# EAGLE board mcat-4cu-b-v2g (EAGLE 6.6.0)
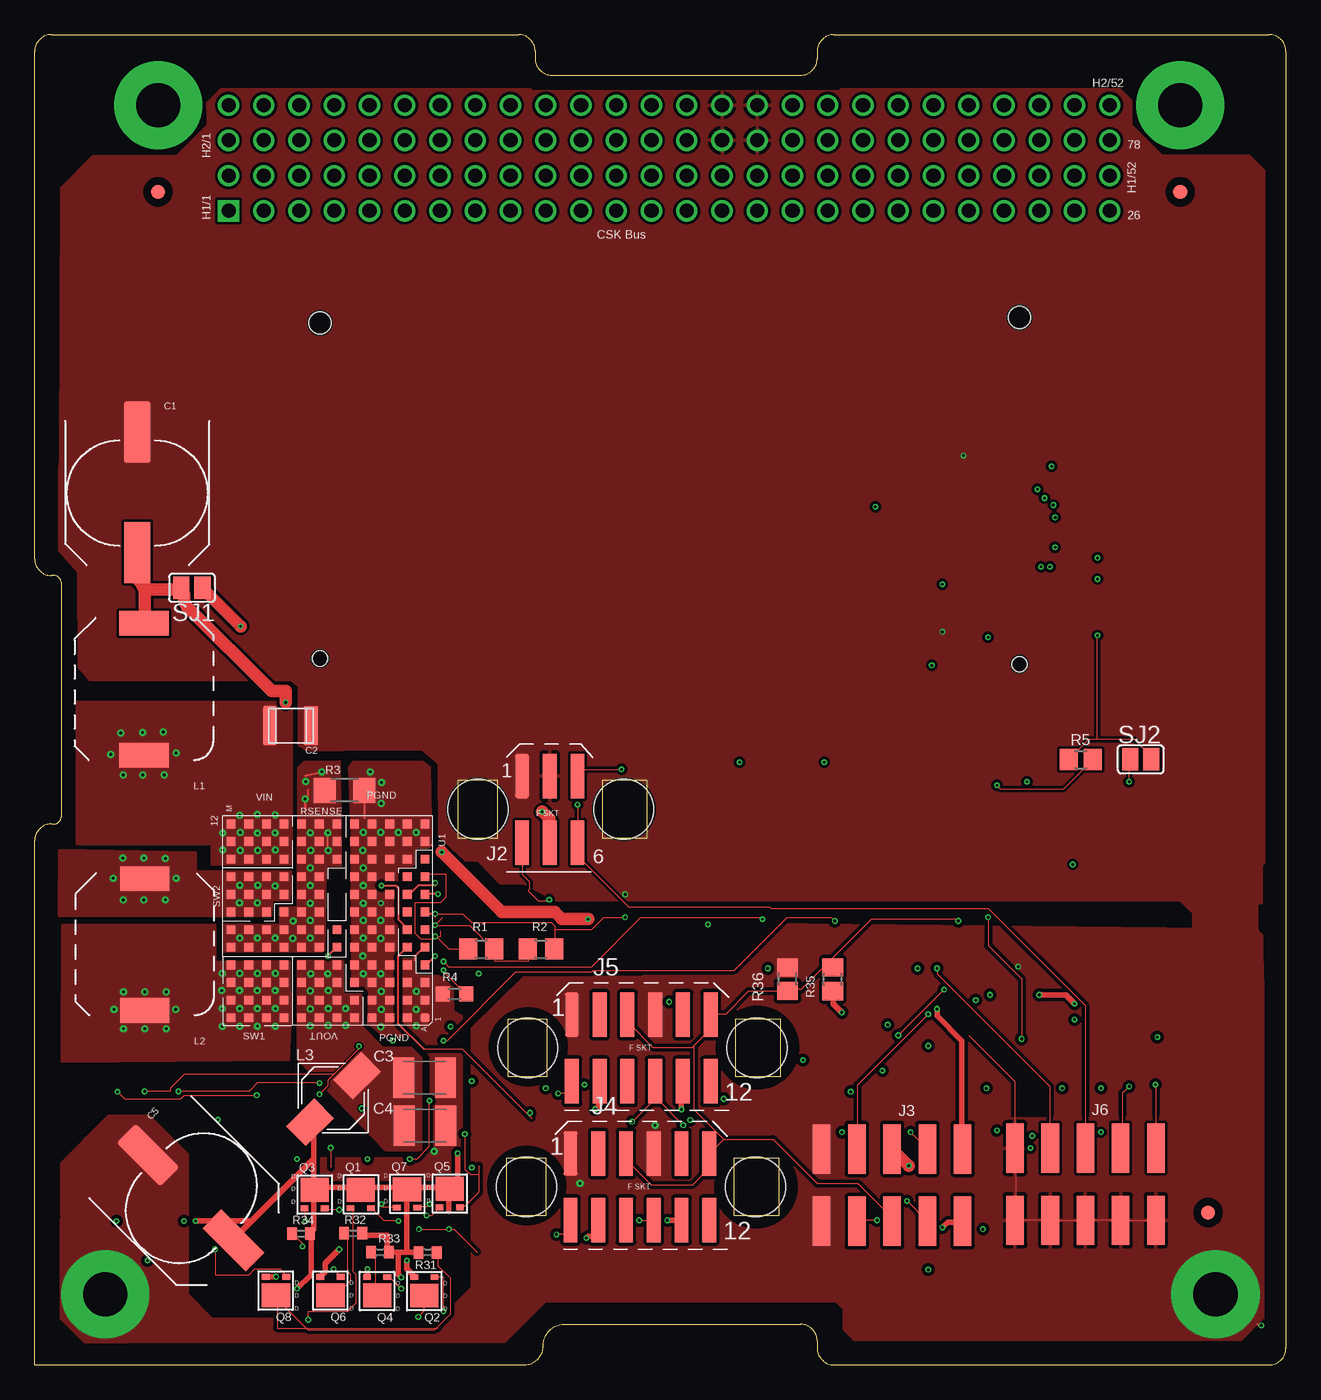
[diagram p5: board, top side]
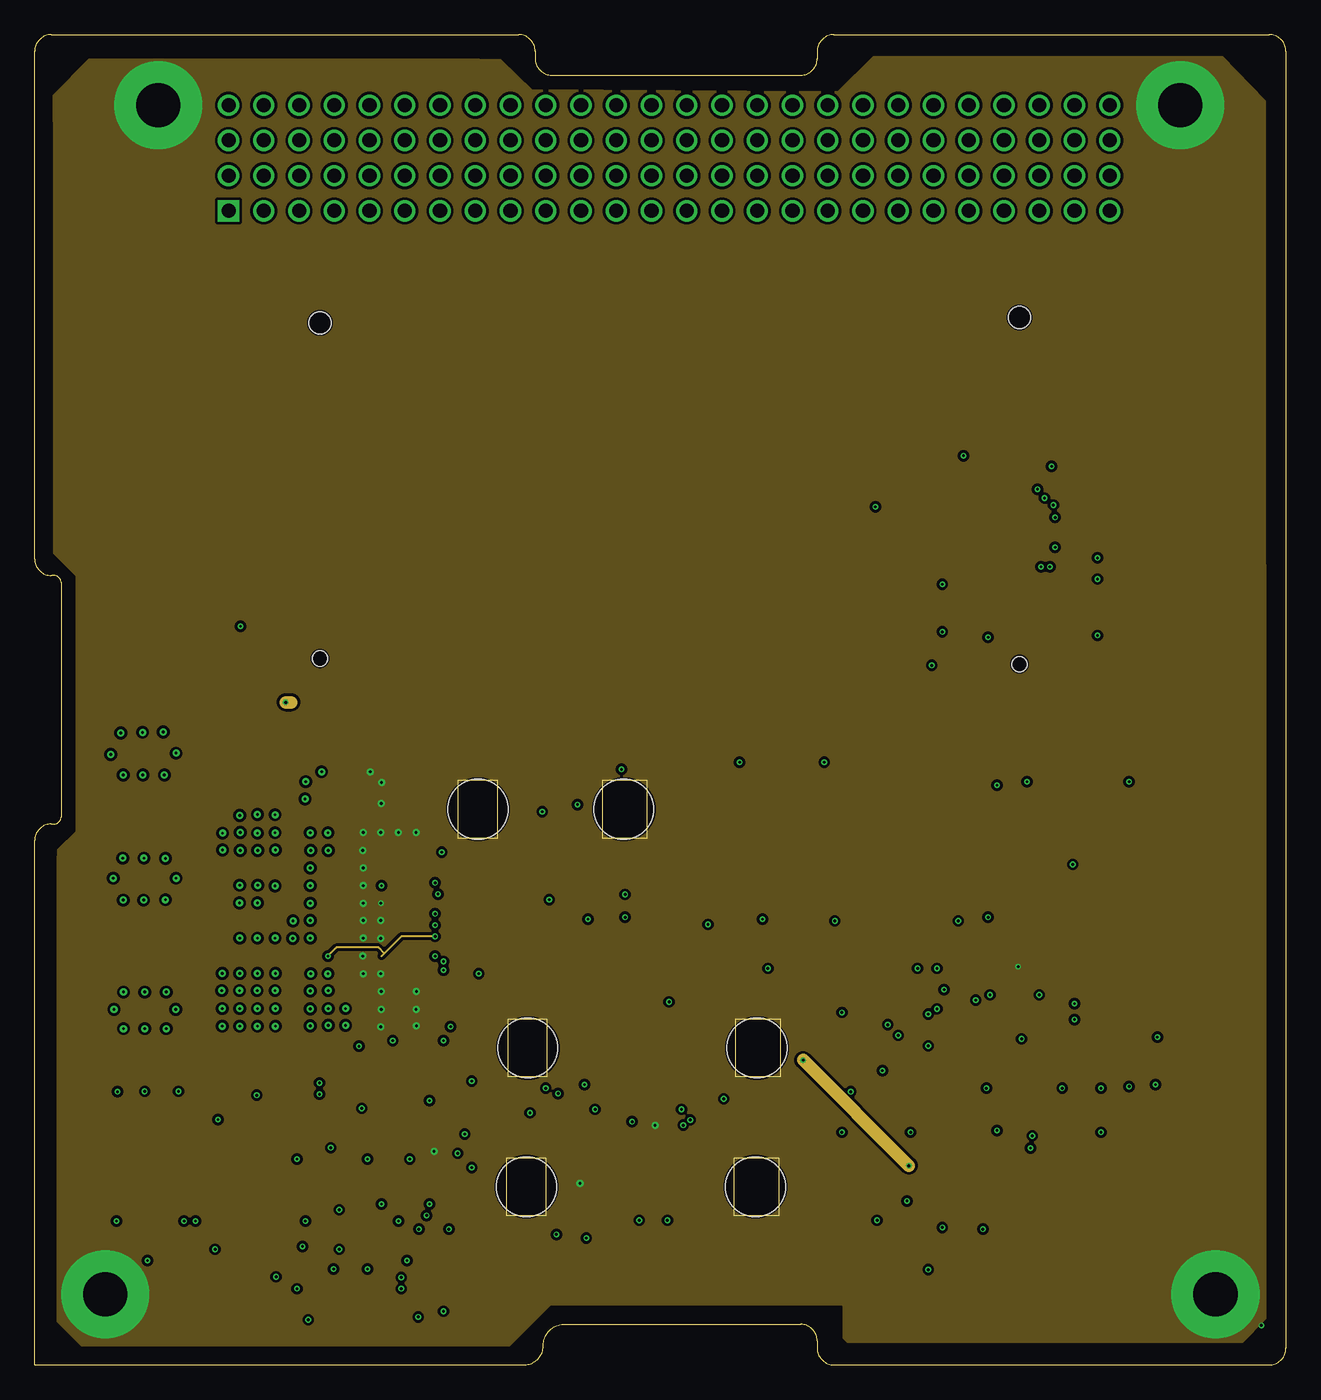
[diagram p6: board, inner layer GND_PLANE]
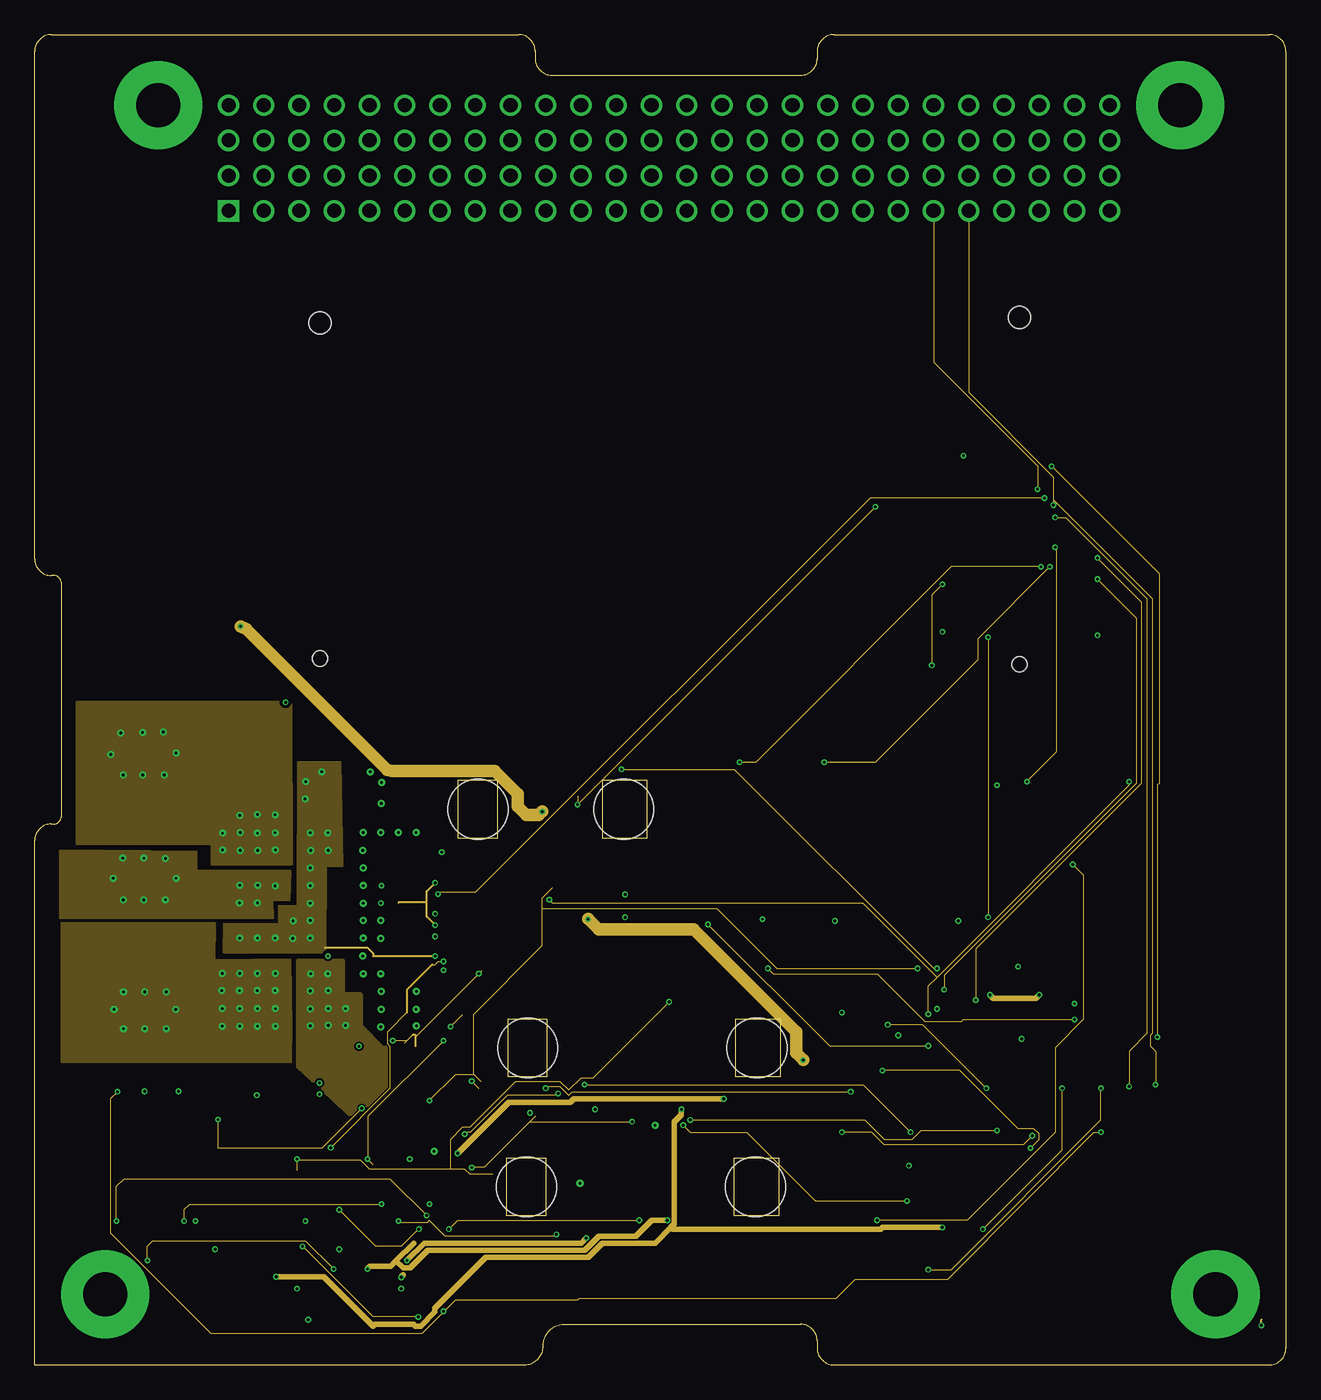
[diagram p7: board, inner layer GND_PLANE/TRACE]
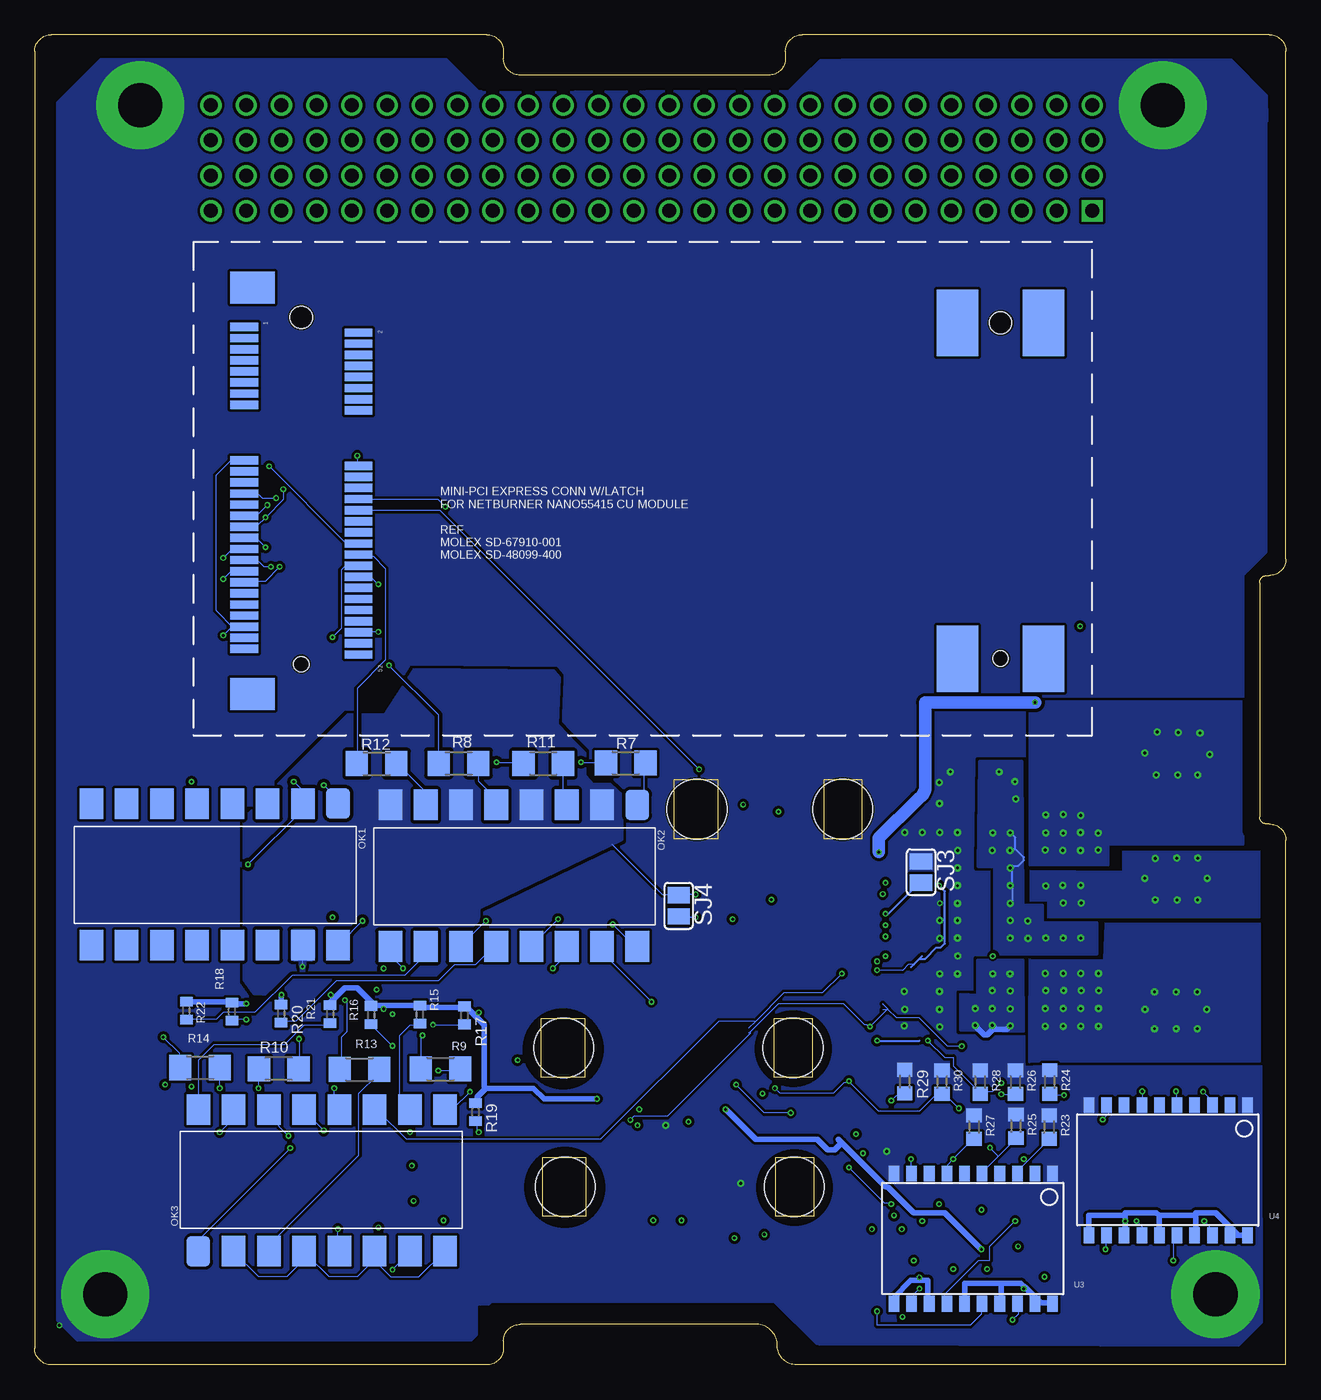
[diagram p8: board, bottom side, seen from below]

Size 90.17 x 95.89 mm. Coordinates in mm from the lower left corner, seen from the top.
Outline: 0,0 34.87,0 35.28,0 arc90 36.65,1.37 arc-90 38.12,2.92 55.19,2.92 arc-90 56.39,1.73 56.39,1.19 arc90 57.58,0 88.98,0 arc90 90.17,1.19 90.17,94.69 arc90 88.98,95.89 57.58,95.89 arc90 56.39,94.69 56.39,94.16 arc-90 55.19,92.96 37.26,92.96 arc-90 36.07,94.16 36.07,94.69 arc90 34.87,95.89 1.19,95.89 arc90 0,94.69 0,58.09 arc90 1.19,56.9 1.4,56.9 arc-90 1.91,56.39 1.91,39.5 arc-90 1.4,38.99 1.19,38.99 arc90 0,37.8 0,0
Copper layers (1+2*15+16): Top 0.035559375mm / dielectric 3.5mil / GND_PLANE 0.01778125mm / dielectric 47mil / GND_PLANE/TRACE 0.01778125mm / dielectric 3.5mil / Bottom 0.035559375mm
Design rules "mcat-4cu-b-v2g *": minimum track width 2mil, minimum drill 8mil, track to track 5mil, track to pad 5mil, pad to pad 5mil, via to via 5mil, smd to smd 5mil, copper to edge 5mil, drill to drill 5mil, minimum pad ring 8mil, minimum via ring 4mil, stop-mask expansion 0mil, vias tented up to drill 8mil, thermal gap 10mil
Net classes: 0 default: clearance 0.205 mm; 1 vout1a2ozcu: width 0.381 mm; 2 vin2a2ozcu: width 0.889 mm
tRestrict: 27 lines
bRestrict: 31 lines

## Footprints (pad centres in the part's own frame; a part is rotated, then mirrored left to right if it is on the bottom)
OS-CON-SVPF-F12 = smd 1.9 x 4.4: A1 0,-4.3; K1 0,4.4
MLCC-X7R-1210 = smd 1 x 2.8: 1 1.6,0.05; 2 -1.35,0.05
C1210K = smd 1.5 x 2.9: 1 -1.5,0; 2 1.5,0
FIDUCIAL_1MM = smd 1 x 1: 1 0,0
CSK-BUS-PKG = drill 1.016 pad 1.524 square: 1 -29.21,-3.81 | drill 1.016 pad 1.524: 2 -29.21,-1.27; 3 -26.67,-3.81; 4 -26.67,-1.27; 5 -24.13,-3.81; 6 -24.13,-1.27; 7 -21.59,-3.81; 8 -21.59,-1.27; 9 -19.05,-3.81; 10 -19.05,-1.27; 11 -16.51,-3.81; 12 -16.51,-1.27; 13 -13.97,-3.81; 14 -13.97,-1.27; 15 -11.43,-3.81; 16 -11.43,-1.27; 17 -8.89,-3.81; 18 -8.89,-1.27; 19 -6.35,-3.81; 20 -6.35,-1.27; 21 -3.81,-3.81; 22 -3.81,-1.27; 23 -1.27,-3.81; 24 -1.27,-1.27; 25 1.27,-3.81; 26 1.27,-1.27; 27 3.81,-3.81; 28 3.81,-1.27; 29 6.35,-3.81; 30 6.35,-1.27; 31 8.89,-3.81; 32 8.89,-1.27; 33 11.43,-3.81; 34 11.43,-1.27; 35 13.97,-3.81; 36 13.97,-1.27; 37 16.51,-3.81; 38 16.51,-1.27; 39 19.05,-3.81; 40 19.05,-1.27; 41 21.59,-3.81; 42 21.59,-1.27; 43 24.13,-3.81; 44 24.13,-1.27; 45 26.67,-3.81; 46 26.67,-1.27; 47 29.21,-3.81; 48 29.21,-1.27; 49 31.75,-3.81; 50 31.75,-1.27; 51 34.29,-3.81; 52 34.29,-1.27; 53 -29.21,1.27; 54 -29.21,3.81; 55 -26.67,1.27; 56 -26.67,3.81; 57 -24.13,1.27; 58 -24.13,3.81; 59 -21.59,1.27; 60 -21.59,3.81; 61 -19.05,1.27; 62 -19.05,3.81; 63 -16.51,1.27; 64 -16.51,3.81; 65 -13.97,1.27; 66 -13.97,3.81; 67 -11.43,1.27; 68 -11.43,3.81; 69 -8.89,1.27; 70 -8.89,3.81; 71 -6.35,1.27; 72 -6.35,3.81; 73 -3.81,1.27; 74 -3.81,3.81; 75 -1.27,1.27; 76 -1.27,3.81; 77 1.27,1.27; 78 1.27,3.81; 79 3.81,1.27; 80 3.81,3.81; 81 6.35,1.27; 82 6.35,3.81; 83 8.89,1.27; 84 8.89,3.81; 85 11.43,1.27; 86 11.43,3.81; 87 13.97,1.27; 88 13.97,3.81; 89 16.51,1.27; 90 16.51,3.81; 91 19.05,1.27; 92 19.05,3.81; 93 21.59,1.27; 94 21.59,3.81; 95 24.13,1.27; 96 24.13,3.81; 97 26.67,1.27; 98 26.67,3.81; 99 29.21,1.27; 100 29.21,3.81; 101 31.75,1.27; 102 31.75,3.81; 103 34.29,1.27; 104 34.29,3.81
M80-68106 = smd 1 x 3.2: 1 -2,2.4; 2 0,2.4; 3 2,2.4; 4 -2,-2.4; 5 0,-2.4; 6 2,-2.4 | hole 4.318: -5.175,0; 5.335,0
AMPMODU-SMT-PIN-HEADER-5X2 = smd 1.27 x 3.556: 1 -4.826,2.54; 2 -2.286,2.54; 3 0.254,2.54; 4 2.794,2.54; 5 5.334,2.54; 6 -4.826,-2.667; 7 -2.286,-2.667; 8 0.254,-2.667; 9 2.794,-2.667; 10 5.334,-2.667
M80-68112 = smd 1 x 3.2: 1 0,2.4; 2 2,2.4; 3 4,2.4; 4 6,2.4; 5 8,2.4; 6 10,2.4; 7 0,-2.4; 8 2,-2.4; 9 4,-2.4; 10 6,-2.4; 11 8,-2.4; 12 10,-2.4 | hole 4.318: -3.175,0; 13.335,0
MSS1048 = smd 3.56 x 1.78: 1 5,9.85; 2 5,0.35
SERIES-POWER-INDUCTORS = smd 2.85 x 2 rotated 45: 1 1.75,1.6; 2 -1.65,-1.75
PS2501L-4 = smd 2.2 x 1.7: 1 -1.6,19.03; 2 -1.6,16.49; 3 -1.6,13.95; 4 -1.6,11.41; 5 -1.6,8.87; 6 -1.6,6.33; 7 -1.6,3.79; 8 -1.6,1.25; 9 8.6,1.25; 10 8.6,3.79; 11 8.6,6.33; 12 8.6,8.87; 13 8.6,11.41; 14 8.6,13.95; 15 8.6,16.49; 16 8.6,19.03
1206-8-CHIPFET = smd 2.032 x 1.727: D 0,1.321 | smd 0.559 x 0.406: G -0.736,0; S 0.736,0
R0805 = smd 1.3 x 1.5: 1 -0.95,0; 2 0.95,0
R1206 = smd 1.6 x 1.803: 1 -1.422,0; 2 1.422,0
R0603 = smd 1 x 1.1: 1 -0.85,0; 2 0.85,0
R0805' = smd 1.3 x 1.5: 1 -0.85,0; 2 0.85,0
R0402 = smd 0.7 x 0.9: 1 -0.65,0; 2 0.65,0
SJ = smd 1.168 x 1.6: 1 -0.762,0; 2 0.762,0
LGA-141-LTC-05-08-1840-B = smd 0.63 x 0.63: A1 -7.116,-10.192; A2 -5.846,-10.192; A3 -4.576,-10.192; A4 -3.306,-10.192; A5 -2.036,-10.192; A6 -0.766,-10.192; A7 0.504,-10.192; A8 1.774,-10.192; A9 3.044,-10.192; A10 4.314,-10.192; A11 5.584,-10.192; A12 6.854,-10.192; B1 -7.116,-8.922; B2 -5.846,-8.922; B3 -4.576,-8.922; B4 -3.306,-8.922; B5 -2.036,-8.922; B6 -0.766,-8.922; B7 0.504,-8.922; B8 1.774,-8.922; B9 3.044,-8.922; B10 4.314,-8.922; B11 5.584,-8.922; B12 6.854,-8.922; C1 -7.116,-7.652; C2 -5.846,-7.652; C3 -4.576,-7.652; C4 -3.306,-7.652; C5 -2.036,-7.652; C6 -0.766,-7.652; C7 0.504,-7.652; C8 1.774,-7.652; C9 3.044,-7.652; C10 4.314,-7.652; C11 5.584,-7.652; C12 6.854,-7.652; D1 -7.116,-6.382; D2 -5.846,-6.382; D3 -4.576,-6.382; D4 -3.306,-6.382; D5 -2.036,-6.382; D6 -0.766,-6.382; D7 0.504,-6.382; D8 1.774,-6.382; D9 3.044,-6.382; D10 4.314,-6.382; D11 5.584,-6.382; D12 6.854,-6.382; E1 -7.116,-5.112; E2 -5.846,-5.112; E3 -4.576,-5.112; E4 -3.306,-5.112; E5 -2.036,-5.112; E6 -0.766,-5.112; E7 0.504,-5.112; E8 1.774,-5.112; E9 3.044,-5.112; E10 4.314,-5.112; E11 5.584,-5.112; E12 6.854,-5.112; F1 -7.116,-3.842; F2 -5.846,-3.842; F3 -4.576,-3.842; F4 -3.306,-3.842; F5 -2.036,-3.842; F6 -0.766,-3.842; F10 4.314,-3.842; F11 5.584,-3.842; F12 6.854,-3.842; G1 -7.116,-2.572; G2 -5.846,-2.572; G3 -4.576,-2.572; G4 -3.306,-2.572; G5 -2.036,-2.572; G6 -0.766,-2.572; G7 0.504,-2.572; G8 1.774,-2.572; G9 3.044,-2.572; G10 4.314,-2.572; G11 5.584,-2.572; G12 6.854,-2.572; H2 -5.846,-1.302; H3 -4.576,-1.302; H4 -3.306,-1.302; H5 -2.036,-1.302; H6 -0.766,-1.302; H7 0.504,-1.302; H8 1.774,-1.302; H9 3.044,-1.302; H10 4.314,-1.302; H11 5.584,-1.302; H12 6.854,-1.302; J5 -2.036,-0.032; J6 -0.766,-0.032; J7 0.504,-0.032; J8 1.774,-0.032; J9 3.044,-0.032; J10 4.314,-0.032; J11 5.584,-0.032; J12 6.854,-0.032; K5 -2.036,1.238; K6 -0.766,1.238; K7 0.504,1.238; K8 1.774,1.238; K9 3.044,1.238; K10 4.314,1.238; K11 5.584,1.238; K12 6.854,1.238; L5 -2.036,2.508; L6 -0.766,2.508; L7 0.504,2.508; L8 1.774,2.508; L9 3.044,2.508; L10 4.314,2.508; L11 5.584,2.508; L12 6.854,2.508; M5 -2.036,3.778; M6 -0.766,3.778; M7 0.504,3.778; M8 1.774,3.778; M9 3.044,3.778; M10 4.314,3.778; M11 5.584,3.778; M12 6.854,3.778; SW1@J1 -7.116,-0.032; SW1@J2 -5.846,-0.032; SW1@J3 -4.576,-0.032; SW1@J4 -3.306,-0.032; SW1@K1 -7.116,1.238; SW1@K2 -5.846,1.238; SW1@K3 -4.576,1.238; SW1@K4 -3.306,1.238; SW1@L1 -7.116,2.508; SW1@L2 -5.846,2.508; SW1@L3 -4.576,2.508; SW1@L4 -3.306,2.508; SW1@M1 -7.116,3.778; SW1@M2 -5.846,3.778; SW1@M3 -4.576,3.778; SW1@M4 -3.306,3.778; VOUT -7.116,-1.302
MOLEX-MINI-PCI-EXPRESS-8MM-52CKT = smd 0.6 x 2: 1 -11.65,-26.8; 2 -11.248,-18.576; 3 -10.85,-26.8; 4 -10.447,-18.576; 5 -10.05,-26.8; 6 -9.648,-18.576; 7 -9.25,-26.8; 8 -8.848,-18.576; 9 -8.45,-26.8; 10 -8.047,-18.576; 11 -7.65,-26.8; 12 -7.247,-18.576; 13 -6.85,-26.8; 14 -6.447,-18.576; 15 -6.05,-26.8; 16 -5.647,-18.576; 17 -2.05,-26.8; 18 -1.647,-18.576; 19 -1.25,-26.8; 20 -0.848,-18.576; 21 -0.45,-26.8; 22 -0.048,-18.576; 23 0.35,-26.8; 24 0.752,-18.576; 25 1.15,-26.8; 26 1.552,-18.576; 27 1.95,-26.8; 28 2.353,-18.576; 29 2.75,-26.8; 30 3.152,-18.576; 31 3.55,-26.8; 32 3.953,-18.576; 33 4.35,-26.8; 34 4.753,-18.576; 35 5.15,-26.8; 36 5.553,-18.576; 37 5.95,-26.8; 38 6.353,-18.576; 39 6.75,-26.8; 40 7.152,-18.576; 41 7.55,-26.8; 42 7.952,-18.576; 43 8.35,-26.8; 44 8.752,-18.576; 45 9.15,-26.8; 46 9.553,-18.576; 47 9.95,-26.8; 48 10.352,-18.576; 49 10.75,-26.8; 50 11.152,-18.576; 51 11.55,-26.8; 52 11.953,-18.576 | smd 2.3 x 3.2: P$1 -14.5,-26.2; P$2 14.8,-26.2 | smd 4.8 x 3: P$3 12.25,24.6; P$4 -11.95,24.6; P$5 -11.95,30.8; P$6 12.25,30.8 | hole 1.6: -12.35,-22.7; -11.95,27.7 | hole 1.1: 12.65,-22.7; 12.25,27.7
20-LEAD-PLASTIC-SO = smd 0.762 x 1.143: 1 0,0; 2 1.27,0; 3 2.54,0; 4 3.81,0; 5 5.08,0; 6 6.35,0; 7 7.62,0; 8 8.89,0; 9 10.16,0; 10 11.43,0; 11 11.43,9.398; 12 10.16,9.398; 13 8.89,9.398; 14 7.62,9.398; 15 6.35,9.398; 16 5.08,9.398; 17 3.81,9.398; 18 2.54,9.398; 19 1.27,9.398; 20 0,9.398

## Placement (x,y rotation side)
C1  68uF  [OS-CON-SVPF-F12]  7.39,62.84 0 top
C2  4.7uF  [MLCC-X7R-1210]  18.56,46.12 180 top
C3  10uF  [C1210K]  28.1,20.7 0 top
C4  10uF  [C1210K]  28.13,17.24 0 top
C5  68uF  [OS-CON-SVPF-F12]  11.29,12.01 45 top
FID1  FIDUCIAL  [FIDUCIAL_1MM]  84.56,10.97 0 top
FID2  FIDUCIAL  [FIDUCIAL_1MM]  8.89,84.56 0 top
FID3  FIDUCIAL  [FIDUCIAL_1MM]  82.55,84.56 0 top
J1  2 x ESQ-126-39-G-D  [CSK-BUS-PKG]  43.18,87 0 top
J2  M80-6810642  [M80-68106]  37.12,40.04 0 top
J3  AMPMODU5X2SMTHDR  [AMPMODU-SMT-PIN-HEADER-5X2]  61.53,13.02 0 top
J4  M80-6811242  [M80-68112]  38.61,12.84 0 top
J5  M80-6811242  [M80-68112]  38.71,22.84 0 top
J6  AMPMODU5X2SMTHDR  [AMPMODU-SMT-PIN-HEADER-5X2]  75.46,13.08 0 top
L1  33uH  [MSS1048]  2.89,43.6 0 top
L2  330uH  [MSS1048]  2.93,25.2 0 top
L3  10uH  [SERIES-POWER-INDUCTORS]  21.48,19.23 0 top
OK1  PS2501L-4  [PS2501L-4]  87.34,38.86 270 bottom
OK2  PS2501L-4  [PS2501L-4]  65.78,38.76 270 bottom
OK3  PS2501L-4  [PS2501L-4]  59.34,9.79 90 bottom
Q1  SI5404BDC  [1206-8-CHIPFET]  23.5,11.31 0 top
Q2  SI5404BDC  [1206-8-CHIPFET]  28.08,6.32 180 top
Q3  SI5404BDC  [1206-8-CHIPFET]  20.17,11.28 0 top
Q4  SI5404BDC  [1206-8-CHIPFET]  24.68,6.32 180 top
Q5  SI5404BDC  [1206-8-CHIPFET]  29.9,11.35 0 top
Q6  SI5404BDC  [1206-8-CHIPFET]  21.32,6.34 180 top
Q7  SI5404BDC  [1206-8-CHIPFET]  26.83,11.33 0 top
Q8  SI5404BDC  [1206-8-CHIPFET]  17.38,6.34 180 top
R1  3K79  [R0805]  32.18,29.97 0 top
R2  1K  [R0805]  36.48,29.97 0 top
R3  70mOhms  [R1206]  22.33,41.41 0 top
R4  4k70.1%  [R0603]  30.26,26.73 0 top
R5  1K  [R0805']  75.38,43.63 0 top
R7  5K42  [R1206]  47.58,43.37 180 bottom
R8  5K42  [R1206]  59.63,43.36 180 bottom
R9  5K42  [R1206]  60.94,21.32 180 bottom
R10  5K42  [R1206]  72.59,21.34 0 bottom
R11  5K42  [R1206]  53.53,43.35 180 bottom
R12  5K42  [R1206]  65.53,43.33 180 bottom
R13  5K420.1%  [R1206]  66.77,21.3 180 bottom
R14  5K420.1%  [R1206]  78.26,21.42 180 bottom
R15  R-US_R0402  [R0402]  62.42,25.24 270 bottom
R16  100K0.1%  [R0402]  65.92,25.22 270 bottom
R17  100K0.1%  [R0402]  59.2,25.19 270 bottom
R18  100K0.1%  [R0402]  75.96,25.46 270 bottom
R19  100K0.1%  [R0402]  58.41,18.22 270 bottom
R20  100K0.1%  [R0402]  72.41,25.31 270 bottom
R21  100K0.1%  [R0402]  68.87,25.28 270 bottom
R22  100K0.1%  [R0402]  79.24,25.53 270 bottom
R23  51K0.1%  [R0603]  17.07,17.14 270 bottom
R24  51K0.1%  [R0603]  17.03,20.39 270 bottom
R25  51K0.1%  [R0603]  19.46,17.19 270 bottom
R26  51K0.1%  [R0603]  19.5,20.37 270 bottom
R27  51K0.1%  [R0603]  22.48,17.13 270 bottom
R28  51K0.1%  [R0603]  22.04,20.37 270 bottom
R29  51k0.1%  [R0603]  27.47,20.41 270 bottom
R30  51k0.1%  [R0603]  24.79,20.37 270 bottom
R31  0.1R  [R0402]  28.32,8.11 180 top
R32  0.1R  [R0402]  22.95,9.49 0 top
R33  0.1R  [R0402]  24.88,8.11 0 top
R34  0.1R  [R0402]  19.19,9.46 0 top
R35  180R  [R0805']  57.51,27.79 90 top
R36  1K  [R0805']  54.25,27.81 90 top
SJ1  0R  [SJ]  11.33,56.01 180 top
SJ2  0R  [SJ]  79.7,43.65 0 top
SJ3  0R  [SJ]  26.3,35.52 270 bottom
SJ4  0R  [SJ]  43.77,33.09 270 bottom
U1  LTM4609MPV#PBF  [LGA-141-LTC-05-08-1840-B]  17.93,32.14 90 top
U2  UCAT-4CU-B-CONTROL-UNITNANO55415  [MOLEX-MINI-PCI-EXPRESS-8MM-52CKT]  48.26,63.16 270 bottom
U3  LT1161ISW  [20-LEAD-PLASTIC-SO]  16.82,13.79 180 bottom
U4  LT1161ISW  [20-LEAD-PLASTIC-SO]  2.77,18.73 180 bottom

## Tracks (layer width: path | path; a pad name or v marks a point on that pad's centre or on a via)
CH1_P18H  (via drill 0.2)
  Top 0.381: v26.82,7.52 26.82,6.91 27.23,6.5 Q2.S | v39.75,9.14 39.88,9.27 40.51,9.27 40.64,9.4 40.64,10.41 J4.8
  GND_PLANE/TRACE 0.381: v26.82,7.52 28.07,8.76 39.37,8.76 v39.75,9.14
CH1_P18L  (via drill 0.2)
  Top 0.051: v26.21,10.36 25.2,10.36 24.38,11.18 Q1.S | v37.59,9.4 38.48,9.4 38.61,9.53 38.61,10.41 J4.7
  GND_PLANE/TRACE 0.051: v26.21,10.36 26.29,10.29 28.32,10.29 28.45,10.41 29.59,9.27 37.47,9.27 v37.59,9.4
CH1HG  (via drill 0.2)
  Top 0.051: v29.46,3.86 29.46,6.3 28.85,6.3 Q2.G
  Bottom 0.051: v29.46,3.86 29.46,2.85 22.76,2.85 21.95,3.66 21.95,4.27 U3.16
CH1LG  (via drill 0.2)
  Top 0.051: v19.71,3.25 19.71,3.86 22.55,3.86 23.16,4.47 23.16,6.5 22.96,6.71 22.96,11.18 Q1.G
  Bottom 0.051: v19.71,3.25 19.3,3.66 19.3,4.27 U3.18
CH1S  (via drill 0.2)
  Top 0.051: v19.3,8.53 19.3,8.74 18.69,9.35 R34.1 | v27.64,3.45 28.04,3.86 28.04,4.88 Q2.D
  GND_PLANE/TRACE 0.051: v19.3,8.53 24.38,3.45 v27.64,3.45
CH2_P18H  (via drill 0.2)
  Top 0.381: v23.98,6.91 23.98,6.5 Q4.S | v45.59,10.41 46.61,10.41 J4.11
  GND_PLANE/TRACE 0.381: v23.98,6.91 24,6.99 24.13,7.11 25.65,7.11 26.04,7.49 | 27.3,8.76 26.04,7.49 | 26.04,7.49 26.54,6.99 27.05,6.99 28.32,8.26 39.62,8.26 40.64,9.27 43.31,9.27 44.45,10.41 v45.59,10.41
CH2_P18L  (via drill 0.2)
  Top 0.051: v21.95,11.18 20.93,11.18 Q3.S | v27.69,9.78 v29.84,9.78 30.23,9.78 31.88,8.13 | v43.56,10.41 44.58,10.41 J4.10
  GND_PLANE/TRACE 0.051: v21.95,11.18 24.59,8.53 26.42,8.53 27.67,9.79 | 27.84,9.96 27.8,9.92 | 27.8,9.92 27.67,9.79 | 27.81,9.91 27.8,9.92 | v27.69,9.78 27.67,9.79 | v43.56,10.41 30.48,10.41 v29.84,9.78
CH2HG  (via drill 0.2)
  Top 0.051: v26.42,5.49 25.6,6.3 Q4.G
  Bottom 0.051: v26.42,5.49 26.82,5.08 26.82,4.47 U3.12
CH2LG  (via drill 0.2)
  Top 0.051: v19.51,10.36 19.51,11.18 Q3.G
  Bottom 0.051: v19.51,10.36 21.34,8.53 21.34,7.52 22.15,7.52 24.59,5.08 24.59,4.47 U3.14
CH2S
  Top 0.051: R33.1 24.38,7.92 24.59,7.72 24.59,5.08 Q4.D
CH3_P18H  (via drill 0.2)
  Top 0.381: v21.95,8.33 20.93,7.32 20.93,6.71 20.73,6.5 Q6.S | v40.39,18.41 40.77,18.8 40.77,20.32 J5.8
  Bottom 0.381: v21.95,8.33 24.59,10.97 26.82,10.97 28.65,12.8 28.83,12.83 32,16 | 32,16 32.26,16.26 | v40.39,18.41 38.23,16.26 33.78,16.26 33.02,15.49 32.51,15.49 32,16
CH3_P18L  (via drill 0.2)
  Top 0.051: 32,14.35 32,13.72 | 32,13.72 32,12.45 30.99,11.43 30.73,11.43 Q5.S | 32,13.72 31.37,13.72 30.99,14.1 v30.99,16.64 | v37.72,19.56 38.73,19.56 38.73,20.32 J5.7
  GND_PLANE/TRACE 0.051: v30.99,16.64 31.11,16.76 31.37,16.76 34.04,19.43 37.59,19.43 v37.72,19.56
CH3HG  (via drill 0.2)
  Top 0.051: v21.54,6.91 21.95,6.5 Q6.G
  GND_PLANE/TRACE 0.051: v21.54,6.91 19.51,8.94 8.51,8.94 8.13,8.56 v8.13,7.52
  Bottom 0.051: 7.92,7.52 v8.13,7.52 8.13,9.14 7.92,9.14 U4.16
CH3LG  (via drill 0.2)
  Top 0.051: v28.25,10.77 28.65,10.77 29.06,11.18 Q5.G
  GND_PLANE/TRACE 0.051: v28.25,10.77 25.6,13.41 6.44,13.41 5.89,12.87 v5.89,10.36
  Bottom 0.051: v5.89,10.36 5.49,9.96 5.49,9.35 U4.18
CH3S
  Top 0.051: R32.1 22.35,9.35 22.55,9.14 22.55,6.71 22.76,6.5 22.76,6.1 21.74,5.08 21.34,5.08 Q6.D
CH4_P18H  (via drill 0.2)
  Top 0.381: v17.4,6.35 16.76,6.35 Q8.S | v46.61,18.41 46.61,20.32 J5.11 | v65.41,9.91 65.79,10.29 66.8,10.29 J3.10
  GND_PLANE/TRACE 0.381: v17.4,6.35 20.83,6.35 24.38,2.79 24.51,2.92 27.3,2.92 27.43,2.79 27.81,2.79 28.83,3.81 28.83,4.06 32.51,7.75 39.88,7.75 40.89,8.76 44.7,8.76 45.85,9.91 | v46.61,18.41 46.61,18.03 46.1,17.53 46.1,10.16 45.85,9.91 | v65.41,9.91 61.09,9.91 60.96,9.78 45.97,9.78 45.85,9.91
CH4_P18L  (via drill 0.2)
  Top 0.051: v28.45,11.58 28.45,11.38 27.64,11.38 Q7.S | 44.7,19.3 44.7,19.18 v43.05,17.53 | 44.7,19.3 44.7,20.32 J5.10 44.7,19.3 | v62.87,11.81 64.26,10.41 J3.9 | 44.7,19.3 v46.74,17.27
  GND_PLANE/TRACE 0.051: 28.45,11.68 v28.45,11.58 | v31.5,14.22 32.38,14.22 35.69,17.53 | 36.07,17.91 35.69,17.53 | 35.69,17.53 v43.05,17.53 | v62.87,11.81 56.26,11.81 51.31,16.76 47.24,16.76 v46.74,17.27
  Bottom 0.051: v31.5,14.22 28.96,11.68 28.45,11.68 v28.45,11.58
CH4HG  (via drill 0.2)
  Top 0.051: v13.01,8.33 13.01,6.5 15.44,6.5 15.85,6.91 17.68,6.91 18.09,6.5 Q8.G
  Bottom 0.051: v13.01,8.33 13.01,9.14 U4.12
CH4LG  (via drill 0.2)
  Top 0.051: v24.99,11.58 24.99,11.38 26.01,11.38 Q7.G
  GND_PLANE/TRACE 0.051: v10.77,10.36 10.77,11.2 11.16,11.58 v24.99,11.58
  Bottom 0.051: v10.77,10.36 10.36,9.96 10.36,9.35 U4.14
CH4S
  Top 0.051: 29.06,2.64 17.48,2.64 17.48,4.88 Q8.D 17.27,4.95 19.68,2.54 28.83,2.54 29.97,3.68 29.97,6.22 29.08,7.11 29.08,8 R31.1 29.06,7.92
GBD
  Bottom 0.051: 65.66,7.62 65.66,8.13 OK3.6 65.66,7.62 | 65.66,7.62 65.66,7.49 64.52,6.35 62.48,6.35 60.71,8.13 OK3.8 | 70.48,7.87 68.96,6.35 66.93,6.35 65.66,7.62 | 70.48,7.87 70.74,8.13 OK3.4 70.48,7.87 | 70.48,7.87 72.01,6.35 74.04,6.35 75.82,8.13 OK3.2
GND  (via drill 0.2)
  Top 0.051: J6.10 J6.9 J6.8 J6.7 70.74,10.41 | 70.74,10.41 70.74,15.62 J6.1 70.61,15.62 70.61,20.45 67.31,23.75 | 70.74,10.41 J6.6
  Bottom 0.051: v42.55,33.91 43.69,33.91 SJ4.1 43.81,33.91 44.96,33.91 48.51,37.47 48.53,37.51 | v65.41,52.83 66.8,52.83 U2.48 | v66.93,65.53 66.93,64.9 U2.18
  pour Top: 12.42,90.55 12.42,90.98 13.44,92 78.18,92 79.02,91.16 79.02,89.38 81.2,87.2 87.53,87.2 88.6,86.13 88.6,36.17 88.42,35.99 88.42,33.25 88.06,33.2 88.11,33.15 88.11,8.33 87.83,8.05 69.82,8.05 69.6,8.28 69.52,17.2 70.1,17.81 82.68,17.93 83.26,18.31 83.49,32.54 82.63,33.4 37.54,33.43 35.31,34.65 33.55,34.67 31.98,36.32 31.06,36.32 29.16,38.1 29.1,43.3 27.93,44.34 22.17,44.27 19.63,44.27 19.02,44.65 19.02,48.9 18.52,49.3 3.99,49.33 3.18,50.32 3.15,57.1 1.75,58.67 1.78,64.64 1.83,65.35 1.91,84.86 4.19,87.15 10.24,87.15 12.47,89.38 12.47,90.47
  pour Bottom (isolate 0.254, no thermals): 67.64,46.89 75.16,39.37 75.16,31.52 75.13,27.76 74.42,26.75 71.15,26.57 67.16,26.57 67.11,26.62 60.78,26.62 60.78,27.41 60.02,28.17 59.05,28.17 58.95,28.27 58.88,28.27 58.06,29.08 58.09,32.89 47.83,37.85 47.8,37.87 47.8,41.07 48.64,41.86 49.91,41.86 50.47,42.47 50.47,44.12 51.16,44.81 52.43,46.15 52.3,49.56 52.73,50.06 62.87,50.16 64.97,46.86
I2C(CLK)  (via drill 0.2)
  Top 0.051: v80.77,20.19 80.77,15.62 J6.5
  GND_PLANE/TRACE 0.051: 73.41,62.36 73.41,64.01 67.31,70.1 J1.43 | 73.41,62.36 v73.41,61.98 | v80.77,20.19 80.77,22.61 80.39,22.99 80.39,23.75 80.52,23.88 80.52,55.24 73.41,62.36
  Bottom 0.051: v73.41,61.98 74.17,61.21 U2.27
I2C(DATA)  (via drill 0.2)
  Top 0.051: v78.87,20.07 78.36,19.56 78.36,15.62 J6.4
  GND_PLANE/TRACE 0.051: v72.26,63.12 72.26,64.77 64.77,72.26 J1.41 | v78.87,20.07 78.87,22.61 80.14,23.88 80.14,55.24 74.3,61.09 v73.53,61.09
  Bottom 0.051: v72.26,63.12 72.26,62.36 v73.53,61.09 74.17,60.45 75.06,60.45 U2.29
INTVCC  (via drill 0.2)
  Top 0.051: v28.85,30.89 28.85,30.68 27.84,30.68 27.43,31.09 27.43,33.33 29.26,33.33 29.67,33.73 29.67,35.36 28.25,35.36 | v28.85,30.89 29.26,30.89 29.26,31.29 | R1.1 31.11,29.97 29.84,29.97 28.96,30.86 v28.85,30.89
  Top 0.152: v21.13,29.46 21.74,30.07 U1.F5 | 28.25,35.36 U1.A9
  GND_PLANE 0.152: 25.2,29.67 26.42,30.89 v28.85,30.89 | 25.2,29.67 24.99,29.46 | v21.13,29.46 21.74,30.07 24.79,30.07 25.2,29.67
N$4  (via drill 0.2)
  GND_PLANE/TRACE 0.051: v64.39,22.99 57.28,22.99 v48.51,31.75
  Bottom 0.051: v64.39,22.99 65.91,24.51 R16.2 | v48.51,31.75 46.86,30.1 OK2.16
N$5  (via drill 0.2)
  GND_PLANE/TRACE 0.051: v74.93,24.89 66.93,24.89 66.8,24.77 64.14,24.77 60.71,28.19 53.21,28.19 v52.83,28.57
  Bottom 0.051: v74.93,24.89 75.95,24.89 R18.2 | v52.83,28.57 51.94,29.46 51.94,30.1 OK2.14
N$7
  Bottom 0.051: R20.2 72.39,24.77 71.37,24.77 68.45,27.69 61.09,27.69 59.94,28.83 58.42,28.83 57.02,30.23 OK2.12
N$9
  Bottom 0.051: R22.2 79.12,24.89 77.09,24.89 76.58,25.4 74.3,25.4 71.63,28.07 63.5,28.07 62.1,29.46 62.1,30.1 OK2.10
N$10
  Bottom 0.051: R21.2 68.96,24.51 70.74,24.51 72.14,23.11 77.22,23.11 78.36,21.97 78.36,18.41 OK3.16
N$11  (via drill 0.2)
  GND_PLANE/TRACE 0.051: v58.17,16.76 60.33,16.76 61.21,15.88 71.25,15.88 v71.88,16.51
  Bottom 0.051: v58.17,16.76 58.29,16.89 58.29,17.53 R19.2 | v71.88,16.51 73.28,17.91 73.28,18.29 OK3.14
N$12  (via drill 0.2)
  GND_PLANE/TRACE 0.051: v61.47,24.51 64.01,24.51 v68.58,19.94
  Bottom 0.051: v61.47,24.51 59.31,24.51 R17.2 | v68.58,19.94 68.58,18.67 68.33,18.41 OK3.12
N$13
  Bottom 0.051: R15.2 62.48,24.51 63.12,24.51 63.88,23.75 63.88,19.05 63.25,18.41 OK3.10
N$16  (via drill 0.2)
  Top 0.051: v69.34,41.78 69.6,41.53 74.17,41.53 76.2,43.56 R5.2
  Bottom 0.051: v69.34,41.78 68.33,40.77 68.33,40.51 OK1.1
OK1E1  (via drill 0.2)
  GND_PLANE/TRACE 0.051: 18.9,14.02 v18.9,14.83 18.92,14.73 23.5,14.73 24.13,14.1 29.97,14.1 | 29.97,14.1 30.99,14.1 31.37,13.72 33.02,13.72 | 29.97,14.1 29.97,16.26 30.86,17.14 31.37,17.14 34.67,20.45 37.85,20.45 38.48,19.81 39.37,20.7 40.26,20.7 v45.72,26.16
  Bottom 0.051: 18.69,14.63 19.51,13.82 U3.3 | 18.69,14.63 17.07,16.26 R23.2 | 18.69,14.63 v18.9,14.83 | v45.72,26.16 49.28,29.72 49.28,30.1 OK2.15
OK1E2  (via drill 0.2)
  Top 0.051: v21.34,15.65 21.34,14.22 | v29.46,29.08 29.84,28.7 40.13,28.7 43.69,32.26 52.32,32.26 v52.45,32.13
  GND_PLANE/TRACE 0.051: v21.34,15.65 25.6,19.91 25.6,22.96 25.4,23.16 25.4,23.98 26.82,25.4 | 28.65,28.85 28.7,28.83 28.83,28.83 29.08,29.08 v29.46,29.08
  GND_PLANE/TRACE 0.152: 26.82,25.4 26.82,27.03 28.65,28.85
  Bottom 0.051: 20.73,15.04 21.95,13.82 U3.5 | 20.73,15.04 19.51,16.26 R25.2 | v21.34,15.65 20.73,15.04 | v52.45,32.13 54.36,30.23 OK2.13
OK1E3  (via drill 0.2)
  Top 0.051: v29.46,23.37 29.72,23.37 34.67,28.32 40.13,28.32 40.26,28.45 50.42,28.45 54.23,32.26 57.4,32.26 v57.66,32
  GND_PLANE/TRACE 0.051: 24.38,14.43 v23.98,14.83 24,14.86 24,17.91 v29.46,23.37
  Bottom 0.051: R27.2 22.55,16.26 v23.98,14.83 24.38,14.43 24.38,13.82 U3.7 | v57.66,32 59.44,30.23 OK2.11
  Bottom 0.152: v29.46,23.37 26.42,23.37
OK1E4  (via drill 0.2)
  Top 0.051: v28.45,19.05 28.45,15.75 27.56,14.86 27.05,14.86 v27.03,14.83
  GND_PLANE/TRACE 0.051: 31.62,20.95 32.13,20.45 | 31.62,20.95 30.35,20.95 v28.45,19.05 | 37.34,34.42 36.58,33.66 36.58,32.89 | 36.58,32.89 36.58,30.23 31.62,25.27 31.62,20.95 | v63.63,28.57 53.47,28.57 49.15,32.89 36.58,32.89
  Bottom 0.051: 27.64,19.71 R29.2 27.56,19.43 28.07,19.43 v28.45,19.05 | v27.03,14.83 27.03,13.82 U3.9 | v63.63,28.57 64.52,29.46 64.52,30.1 OK2.9
OK2E1  (via drill 0.2)
  Top 0.051: v16,19.43 10.79,19.43 10.54,19.18 6.48,19.18 v5.97,19.68
  GND_PLANE/TRACE 0.051: v76.83,16.76 76.33,16.76 66.19,6.58 65.79,6.17 59.13,6.17 57.76,4.8 39.24,4.8 39.12,4.67 30.33,4.67 27.94,2.29 12.7,2.29 5.46,9.53 5.46,19.18 v5.97,19.68
  Bottom 0.051: v16,19.43 17.02,19.43 R24.2 | v5.97,19.68 5.33,19.05 5.33,18.8 U4.3 | v76.83,16.76 75.95,17.65 75.95,18.29 OK3.15
OK2E2  (via drill 0.2)
  Top 0.051: v20.52,19.51 21.13,20.12 21.13,20.52 21.54,20.93 | 21.54,20.93 23.37,22.76 v23.37,22.96 | v7.92,19.71 9.75,19.71 9.75,19.91 10.77,20.93 21.54,20.93
  GND_PLANE/TRACE 0.051: v29.97,24.38 30.86,25.27 | v69.34,16.89 63.88,16.89 63.25,16.26 61.21,16.26 59.82,17.65 v47.24,17.65
  Bottom 0.051: v23.37,22.96 24.38,22.96 26.42,24.99 28.04,24.99 28.65,25.6 | 28.65,25.6 28.7,25.65 | 28.7,25.65 29.06,26.01 | v20.52,19.51 19.51,19.51 R26.2 | v7.92,19.71 7.92,18.9 U4.5 | 28.65,25.6 29.06,25.6 | 28.7,25.65 v29.97,24.38 30.1,24.38 30.23,24.51 30.35,24.51 31.88,26.04 36.58,26.04 38.61,24 | 38.61,24 38.73,23.88 | v69.34,16.89 70.74,18.29 OK3.13 | v47.24,17.65 46.99,17.91 44.58,17.91 38.61,23.88 38.61,24
OK2E3  (via drill 0.2)
  Top 0.051: v10.36,19.71 15.44,19.71 16.05,20.32 v20.52,20.32
  GND_PLANE/TRACE 0.051: 27.23,23.77 26.82,23.37 | 26.82,23.37 26.62,23.16 | 26.82,23.37 v25.81,23.37 | 27.43,23.62 v32,28.19 32.26,28.45
  GND_PLANE/TRACE 0.152: 27.23,23.77 27.43,23.77 27.43,23.62 27.43,22.96
  Bottom 0.051: v25.81,23.37 24.59,22.15 23.98,22.15 23.98,21.54 22.15,19.71 R28.2 21.95,19.71 21.13,19.71 v20.52,20.32 | v10.36,19.71 10.36,18.9 U4.7 | 38.23,24.77 36.2,26.8 33.4,26.8 v32,28.19 | 38.23,24.77 38.73,24.26 | 38.23,24.77 40.89,24.77 49.4,16.26 63.37,16.26 65.41,18.29 65.66,18.29 OK3.11
OK2E4  (via drill 0.2)
  GND_PLANE/TRACE 0.051: v23.57,18.49 20.73,15.65 13.21,15.65 v13.21,17.68 | v31.5,20.45 32,19.94 | v36.83,19.94 36.96,20.07 37.85,20.07 38.48,19.43 38.73,19.68 v58.8,19.68
  Bottom 0.051: v23.57,18.49 24.59,19.51 R30.2 24.79,19.51 25.2,19.51 26.42,18.29 29.34,18.29 v31.5,20.45 31.62,20.45 31.75,20.32 31.88,20.32 32.64,19.56 36.45,19.56 v36.83,19.94 | v13.21,17.68 12.8,18.09 12.8,18.69 U4.9 | v58.8,19.68 60.07,18.41 60.58,18.41 OK3.9
P3  (via drill 0.2)
  Top 0.051: 76.58,45.09 79.25,45.09 80.39,43.94 80.39,43.69 SJ2.2 | 76.58,45.09 75.95,45.09 74.55,43.69 R5.1 | 76.58,45.09 v76.58,52.58
  Bottom 0.051: 75.82,53.09 76.07,53.09 v76.58,52.58 | 75.82,53.09 75.18,53.09 U2.47 75.82,53.09 | 75.82,53.09 77.09,54.36 77.09,64.14 76.07,65.15 75.18,65.15 U2.17
P3_SW  (via drill 0.2)
  Top 0.051: v37.08,33.53 36.96,33.4 36.32,33.4 35.56,34.16 35.69,34.29 35.69,34.8 35.18,35.31 35.18,37.59 J2.4 | v78.87,42.04 78.87,43.56 SJ2.1 | v64.39,25.27 59.31,20.19 59.31,15.62 J3.2
  GND_PLANE/TRACE 0.051: v37.08,33.53 37.34,33.27 59.69,33.27 65.02,27.94 | v78.87,42.04 78.87,41.78 65.02,27.94 | 65.02,27.94 64.39,27.3 v64.39,25.27
P18_SW1
  Bottom 0.051: R7.1 46.23,43.31 46.23,40.89 46.74,40.39 OK2.1
P18_SW2
  Bottom 0.051: R8.1 58.17,43.31 58.17,42.04 57.02,40.89 57.02,40.39 OK2.5
P18_SW3  (via drill 0.2)
  GND_PLANE/TRACE 0.051: v61.09,21.21 66.67,21.21 70.87,17.02 72.01,17.02 72.39,16.64 72.39,16.26 v71.75,15.62
  Bottom 0.051: v61.09,21.21 59.56,21.21 R9.1 | v71.75,15.62 78.36,9.02 78.36,8.26 OK3.1
P18_SW4  (via drill 0.2)
  GND_PLANE/TRACE 0.051: v74.04,19.94 74.04,15.49 v68.33,9.78
  Bottom 0.051: v74.04,19.94 74.04,21.34 R10.1 | v68.33,9.78 68.33,8.26 OK3.5
P18_SW5
  Bottom 0.051: R11.1 52.07,43.31 52.07,40.51 51.94,40.39 OK2.3
P18_SW6
  Bottom 0.051: R12.1 64.01,43.31 62.1,41.4 62.1,40.39 OK2.7
P18_SW7
  Bottom 0.051: R13.1 65.41,21.21 65.41,20.95 66.8,19.56 66.8,15.11 73.28,8.64 73.28,8.26 OK3.3
P18_SW8  (via drill 0.2)
  GND_PLANE/TRACE 0.051: v76.83,19.94 76.83,17.65 66.04,6.86 v64.39,6.86
  Bottom 0.051: v76.83,19.94 76.83,21.34 R14.1 | v64.39,6.86 63.12,8.13 OK3.7
PBATT_SW  (via drill 0.2)
  Top 0.889: v14.83,53.24 12.19,55.88 SJ1.1 | v36.58,39.88 37.08,39.37 37.08,37.72 J2.5
  GND_PLANE/TRACE 0.889: v14.83,53.24 15.24,53.03 25.4,42.88 25.78,42.8 33.15,42.8 34.8,41.15 34.8,40.26 35.43,39.62 36.32,39.62 v36.58,39.88
PGND  (via drill 0.2, 0.2 pad 0.51, 3.17 pad 6.35)
  Top 0.051: 26.82,24.79 U1.B1
  Top 0.152: v5.08,5.08 5.08,4.32 | v5.08,5.08 6.86,6.86 | 6.91,6.91 v5.08,5.08 | U1.A5 28.04,30.07 27.43,29.46 27.43,29.26 27.36,29.18 | 23.77,39.42 23.77,41.25 R3.2 | v88.39,2.85 88.19,2.85 88.1,2.93 | 28.65,37.39 28.55,37.47
  GND_PLANE/TRACE 0.152: v88.39,2.85 88.39,3.25
  Bottom 0.051: v70.87,28.7 70.87,30.23 OK1.15
  other vias: 85.09,5.08 8.89,90.81 27.48,38.38 26.21,38.38 24.94,38.38 23.67,38.38 23.65,37.08 23.67,35.81 23.67,34.54 23.67,33.27 24.94,33.27 23.67,32.03 24.94,32.03 23.67,30.76 24.94,30.73 23.67,28.19 24.94,28.19 24.97,26.92 24.97,25.63 23.65,29.46 24.94,24.36 27.51,26.92 27.48,25.63 27.51,24.43 24.18,42.75 24.99,41.99 24.97,40.46 28.78,15.39 39.29,13.08 44.7,17.27 82.55,90.81
  pour GND_PLANE (isolate 0.127, no thermals): 3.4,1.45 34.2,1.45 37.15,4.4 58.2,4.4 58.35,4.25 58.35,1.95 58.6,1.7 87,1.7 88.65,3.35 88.65,57.65 88.6,57.7 88.6,91.1 85.53,94.25 60.47,94.22 57.94,91.75 56.49,91.7 35.79,91.85 33.56,94.02 32,94.05 3.95,94.05 1.43,91.48 1.4,89.65 1.45,89.6 1.45,58.5 3.05,56.9 3.08,38.41 1.75,37.13 1.75,36.75 1.7,36.6 1.7,3.15
  pour Bottom (isolate 0.127, rank 2, no thermals): 3.4,1.45 34.2,1.45 37.15,4.4 58.2,4.4 58.35,4.25 58.35,1.95 58.6,1.7 87,1.7 88.65,3.35 88.65,57.65 88.6,57.7 88.6,91.1 85.53,94.25 60.47,94.22 57.94,91.75 56.49,91.7 35.79,91.85 33.56,94.02 32,94.05 3.95,94.05 1.43,91.48 1.4,89.65 1.45,89.6 1.45,58.5 3.05,56.9 3.08,38.41 1.75,37.13 1.75,36.75 1.7,36.6 1.7,3.15
  pour Top (isolate 0.254, no thermals): 6.63,1.47 3.71,1.47 1.75,3.43 1.75,14.43 5.31,17.98 8.26,17.98 11.02,15.21 11.02,5.11 12.78,3.35 29.26,3.35 31.5,5.59 31.5,24.28 35.28,27.99 43.87,27.99 45.92,31.9 88.04,31.42 88.47,30.99 88.47,29.67 88.54,27.13 88.54,3.38 86.94,1.78 59.05,1.78 58.32,2.51 58.32,3.99 57.76,4.55 36.8,4.55 33.88,1.63 6.71,1.63 6.58,1.5
  pour Top (isolate 0.254, no thermals): 22.83,38.1 22.66,43.08 22.99,43.51 27.95,43.51 28.48,43.11 28.55,39.24 28.55,37.47 28.35,37.26 27.51,37.26 27.3,37.06 27.3,36.07 27.13,35.89 26.34,35.89 26.14,35.69 26.14,29.57 26.39,29.31 27.23,29.31 27.41,29.13 27.41,28.32 27.64,28.09 29.67,28.07 30.1,27.71 30.18,25.5 30.76,25.17 30.76,8.08 29.41,6.73 21.62,6.73 17.83,10.52 17.83,13.28 19.46,14.91 28.12,14.91 28.55,15.7 28.52,22.2 27.25,23.65 25.35,23.65 25.27,23.72 25.02,23.77 24.03,24.61 24.1,26.92 23.77,27.3 22.89,27.33
PGOOD_PMA  (via drill 0.2)
  Top 0.051: 28.04,22.76 28.07,22.73 30.86,22.73 35.56,18.03 | 35.56,18.03 35.81,17.78 | v63.12,16.76 64.26,15.62 J3.4 | 35.56,18.03 v35.69,18.16
  Top 0.152: 28.04,22.76 26.21,24.59 26.21,29.46 26.82,30.07 U1.B5
  GND_PLANE/TRACE 0.051: v63.12,16.76 59.69,20.19 v39.62,20.19
  Bottom 0.051: v39.62,20.19 37.59,18.16 v35.69,18.16
RSENSE  (via drill 0.2, 0.2 pad 0.51)
  Top 0.152: v28.85,29.46 28.25,28.85 U1.A4 | v21.13,38.35 21.13,37.19 v21.16,37.08 | v19.48,40.79 19.51,40.03 19.51,40.84 19.71,41.05 19.71,41.45 | 19.51,42.47 v20.68,42.75
  GND_PLANE/TRACE 0.152: v28.85,29.46 24.38,29.46 24.38,29.67 23.98,30.07 20.93,30.07
  Bottom 0.152: v19.86,38.35 19.51,38 19.51,37.19 | 19.51,37.19 19.71,37.19 v19.89,37.08 | 19.71,34.54 19.71,33.33 v19.86,33.27 | 19.71,34.54 19.71,35.76 v19.86,35.81 19.71,35.97 19.3,35.97 18.9,36.37 18.9,36.58 19.51,37.19 | 19.71,34.54 v19.86,34.54
  other vias: 14.78,30.76 16.05,30.76 17.32,30.76 18.59,30.73 19.86,30.76 18.62,32 19.86,32.03 19.53,42.04
  pour Bottom (isolate 0.25, no thermals): 13.63,31.86 17.56,31.86 17.56,33.13 18.96,33.16 19.04,43.48 22.05,43.51 22.18,35.93 20.98,35.91 20.98,29.63 13.63,29.63
  pour Top (isolate 0.25, no thermals): 13.63,31.73 17.71,31.73 17.66,33.01 18.96,33.06 18.98,43.06 19.41,43.49 21.98,43.53 22.05,35.93 20.98,35.91 20.88,29.76 13.63,29.76
  pour GND_PLANE/TRACE (isolate 0.25, no thermals): 13.66,31.81 17.63,31.78 17.61,33.08 18.96,33.08 18.99,43.46 22,43.48 22.18,35.93 20.98,35.91 20.93,29.71 13.63,29.71
SETFREQ  (via drill 0.2)
  Top 0.051: 29.39,32.24 v28.85,31.7 28.96,31.62 31.37,31.62 33.02,29.97 R1.2 33.15,29.84 33.15,29.08 35.56,29.08 35.56,29.97 R2.1
  Top 0.152: v28.85,34.75 28.85,34.54 27.64,34.54 27.03,33.93 U1.B8
  GND_PLANE/TRACE 0.152: 28.25,33.33 26.21,33.33 | 28.25,33.33 28.25,32.31 v28.85,31.7 | v28.85,34.75 28.25,34.14 28.25,33.33
SGND  (via drill 0.2)
  Top 0.051: v28.85,32.51 30.86,32.51 31.5,31.88 37.21,31.88 37.47,31.62 37.47,31.37 | 37.47,31.37 37.47,30.1 R2.2 | v42.55,32.26 41.02,32.26 40.13,31.37 37.47,31.37
  Top 0.152: U1.A7 28.25,32.51 v28.85,32.51 28.85,32.31
  Bottom 0.051: v42.55,32.26 43.69,32.26 SJ4.2
  Bottom 0.152: v28.85,32.51 28.65,32.51 26.42,34.75 SJ3.2
SW1  (via drill 0.2 pad 0.51)
  other vias: 14.78,24.41 16.05,24.41 17.35,24.41 13.51,24.41 6.4,24.23 9.47,24.23 7.92,24.23 5.71,25.63 10.16,25.63 6.4,26.87 9.47,26.87 7.92,26.87 14.78,25.68 16.05,25.68 17.35,25.68 13.51,25.68 14.78,28.22 16.05,28.22 17.35,28.22 13.51,28.22 14.76,26.97 16.03,26.97 17.32,26.97 13.49,26.97
  pour Bottom (no thermals): 18.47,29.24 13.08,29.18 13,31.83 1.91,31.83 1.91,21.84 18.49,21.79 18.52,24.41 18.47,28.85
  pour GND_PLANE/TRACE (isolate 0.127, no thermals): 18.44,29.21 12.98,29.16 13,31.83 1.91,31.83 1.91,21.84 18.49,21.79 18.52,24.41
  pour Top (no thermals): 13.06,29.03 13.06,31.7 1.96,31.7 1.93,21.84 18.34,21.97 18.44,24.46 18.41,29.11
SW2  (via drill 0.2 pad 0.51)
  other vias: 6.38,33.5 9.42,33.53 7.85,33.5 9.42,36.5 6.35,36.53 7.87,36.53 10.19,35.08 5.66,35.08 14.78,34.57 16.08,34.57 14.76,33.3 16.05,33.3 17.32,34.52
  pour Top (no thermals): 11.56,35.56 11.58,36.91 1.8,37.08 1.78,32.41 16.99,32.41 17.07,33.55 18.34,33.53 18.47,35.53
  pour GND_PLANE/TRACE (no thermals): 11.68,35.64 11.68,36.98 1.8,37.08 1.8,32.21 17.2,32.21 17.17,33.5 18.39,33.48 18.44,35.61
  pour Bottom (isolate 0.254, no thermals): 11.81,35.61 11.81,37.03 1.8,37.08 1.8,32.21 17.17,32.18 17.2,32.21 17.2,33.4 18.47,33.4 18.47,35.66
SW_P18H1  (via drill 0.2)
  GND_PLANE/TRACE 0.051: v56.9,43.43 60.58,43.43 67.94,50.8 67.94,52.32 v73.15,57.53
  Bottom 0.051: v56.9,43.43 54.99,43.43 R11.2 | v73.15,57.53 73.66,57.53 74.04,57.91 75.06,57.91 U2.35
SW_P18H2
  Bottom 0.051: R12.2 66.93,43.43 66.93,48.77 64.9,50.8 64.9,57.4 65.79,58.29 66.8,58.29 U2.34
SW_P18H3  (via drill 0.2)
  GND_PLANE/TRACE 0.051: v67.82,26.29 67.82,29.97 79.76,41.91 79.76,54.99 v76.58,58.17
  Bottom 0.051: v67.82,26.29 67.69,26.16 67.69,24 68.07,23.62 68.07,21.34 R13.2 | v76.58,58.17 75.95,58.8 75.18,58.8 U2.33
SW_P18H4  (via drill 0.2)
  GND_PLANE/TRACE 0.051: v80.9,23.62 80.9,41.78 81.03,41.91 81.03,57.02 v73.28,64.77
  Bottom 0.051: v80.9,23.62 79.76,22.48 79.76,21.46 R14.2 | v73.28,64.77 67.82,59.31 66.93,59.31 U2.32
SW_P18L1  (via drill 0.2)
  GND_PLANE/TRACE 0.051: v50.8,43.43 51.94,43.43 66.04,57.53 v72.52,57.53
  Bottom 0.051: v50.8,43.43 49.02,43.43 R7.2 | v72.52,57.53 73.53,56.52 75.06,56.52 U2.39
SW_P18L2  (via drill 0.2)
  GND_PLANE/TRACE 0.051: v64.64,50.42 64.64,55.5 v65.41,56.26
  Bottom 0.051: v64.64,50.42 61.09,46.86 61.09,43.43 R8.2 | v65.41,56.26 65.91,56.77 66.8,56.77 U2.38
SW_P18L3  (via drill 0.2)
  Top 0.051: v65.53,27.05 v62.23,23.75
  GND_PLANE/TRACE 0.051: v65.53,27.05 65.53,28.07 79.38,41.91 79.38,53.85 v76.58,56.64
  Bottom 0.051: v62.23,23.75 62.36,23.62 62.36,21.34 R9.2 | v76.58,56.64 76.07,57.15 75.18,57.15 U2.37
SW_P18L4  (via drill 0.2)
  Top 0.051: v71.12,23.5 71.12,27.81 68.71,30.23 v68.71,32.26
  GND_PLANE/TRACE 0.051: v68.71,52.45 v68.71,32.26
  Bottom 0.051: v71.12,23.5 71.12,21.46 R10.2 | v68.71,52.45 68.07,53.09 68.07,57.28 67.82,57.53 66.93,57.53 U2.36
SW_RUNPMA  (via drill 0.2)
  Top 0.152: v29.06,33.93 28.25,33.93 U1.A8
  GND_PLANE/TRACE 0.051: v29.06,33.93 29.08,34.04 31.75,34.04 60.2,62.48 v72.77,62.48
  Bottom 0.051: v72.77,62.48 73.79,62.48 74.04,62.74 75.06,62.74 U2.23
SW_TP1  (via drill 0.2)
  Top 0.051: v60.71,10.41 59.31,10.41 J3.7
  GND_PLANE/TRACE 0.051: v73.53,58.93 73.66,58.8 73.66,44.2 v71.5,42.04 | v60.71,10.41 67.18,10.41 73.53,16.76 73.53,22.86 75.56,24.89 75.56,35.31 v74.8,36.07
  Bottom 0.051: v73.53,58.93 74.17,59.56 75.06,59.56 U2.31 | v71.5,42.04 70.87,41.4 70.87,40.51 OK1.2 70.87,40.39 70.87,40.01 v74.8,36.07
TP1_OUT  (via drill 0.2)
  Top 0.051: J4.3 42.67,15.11 42.67,14.73 44.45,12.95 47.37,12.95 48.51,14.1 48.51,15.11 J4.6 48.64,15.24 49.66,16.26 | 49.66,16.26 53.21,16.26 56.39,13.08 59.31,13.08 61.72,10.67 61.72,10.41 J3.8 | 47.5,22.99 48.64,24.13 48.64,25.15 J5.6 48.77,25.27 49.78,25.27 51.44,26.92 54.23,26.92 R36.1 54.36,27.05 55.24,27.05 56.77,28.57 | 47.5,22.99 47.37,22.86 44.58,22.86 42.8,24.64 42.8,25.15 J5.3 | 56.77,28.57 57.4,28.57 R35.2 56.77,28.57 | v66.55,32 66.42,32.13 60.33,32.13 56.77,28.57 | 49.66,16.26 47.5,18.41 47.5,22.99
  Bottom 0.051: v66.55,32 68.2,30.35 OK1.16
UART0_RX  (via drill 0.2)
  Top 0.051: v39.12,40.39 39.12,37.72 J2.6 39.24,37.59 39.24,36.58 42.8,33.02 52.96,33.02 53.09,32.89 68.71,32.89 75.69,25.91 75.69,15.62 J6.3
  GND_PLANE/TRACE 0.051: 39.12,41.02 v39.12,40.39 v60.58,61.85
  Bottom 0.051: v60.58,61.85 61.09,62.36 66.8,62.36 U2.24
UART0_TX  (via drill 0.2)
  Top 0.051: 39.37,42.67 39.24,42.55 J2.3 39.37,42.67 | v42.29,42.93 39.62,42.93 39.37,42.67 | v65.02,28.57 65.02,28.19 73.15,20.07 73.15,15.62 J6.2
  GND_PLANE/TRACE 0.051: v65.02,28.57 64.77,28.57 50.42,42.93 v42.29,42.93
  Bottom 0.051: v42.29,42.93 60.96,61.59 66.8,61.59 U2.26
VBATT_IN  (via drill 0.2)
  Top 0.889: 7.92,55.88 10.57,55.88 SJ1.2 10.77,55.47 10.77,55.07 10.97,54.66 17.07,48.56 18.09,48.56 v18.09,47.75 | 7.92,55.88 7.92,53.65 L1.1 | 7.92,55.88 7.72,56.29 7.52,56.49 7.52,58.52 C1.A1 | v29.34,36.96 33.66,32.64 37.47,32.64 37.97,32.13 v39.88,32.13 | v62.99,14.35 61.85,15.49 J3.3
  GND_PLANE 0.889: v18.09,47.75 18.49,47.75 | v55.37,21.97 v62.99,14.35
  GND_PLANE/TRACE 0.889: v55.37,21.97 54.86,22.48 54.86,24 47.5,31.37 40.64,31.37 v39.88,32.13
  Bottom 0.889: v18.09,47.75 26.01,47.75 26.01,41.45 26.21,41.05 26.54,40.77 29.34,37.97 v29.34,36.96
VFB  (via drill 0.2)
  Top 0.051: v29.46,28.45 29.46,28.32 30.99,26.8 R4.2
  Top 0.152: v24.99,34.54 26.01,34.54 26.21,34.34 26.21,32.11 26.82,31.5 U1.B6
  Bottom 0.051: v29.46,28.45 27.64,28.45 27.23,28.85 26.82,28.85
  Bottom 0.152: 27.03,28.65 26.82,28.85 26.42,29.26 | 26.42,29.26 26.21,29.46 | v24.99,34.54 24.59,34.14 24.59,30.37 24.88,30.07 25.2,30.07 26.01,29.26 26.42,29.26
VIN  (via drill 0.2 pad 0.51)
  other vias: 6.38,42.52 7.8,42.52 9.35,42.52 6.2,45.54 7.77,45.59 9.27,45.62 10.19,44.09 5.49,43.99 14.81,38.38 16.05,38.33 17.32,38.35 14.81,37.08 16.08,37.08 17.35,37.11 13.54,38.33 13.54,37.11 14.78,39.6 16.05,39.67 17.32,39.65
  pour Bottom (isolate 0.254, no thermals): 18.52,36.04 12.78,36.02 12.78,37.47 3.05,37.52 3.05,47.8 18.49,47.85
  pour GND_PLANE/TRACE (no thermals): 18.52,36.04 12.78,36.02 12.78,37.47 3.05,37.52 3.05,47.8 18.49,47.85
  pour Top (no thermals): 18.52,36.04 12.78,36.02 12.78,37.47 3.05,37.52 3.05,47.8 18.52,47.83
VOUT  (via drill 0.2 pad 0.51)
  Bottom 0.406: v19.86,24.43 20.12,24.18 20.93,24.18 21.03,24.28 | 21.03,24.28 21.13,24.38 v21.16,24.46 | 21.03,24.28 21.54,23.77 21.74,23.77 22.35,24.38 v22.4,24.46
  other vias: 19.86,25.65 21.16,25.68 22.4,25.68 19.86,26.95 21.16,26.97 19.89,28.19 21.13,28.19
  pour Top (no thermals): 27.66,15.42 25.32,15.39 18.97,22.02 18.97,29.16 22.23,29.16 22.23,26.75 23.5,26.75 23.5,26.7 23.52,26.7 23.52,24.46 25.1,22.89 27.13,22.89 27.84,22.17 27.84,15.49
  pour GND_PLANE/TRACE (no thermals): 27.71,15.57 25.32,15.57 18.97,21.46 18.97,29.16 22.23,29.16 22.23,26.75 23.5,26.75 23.5,26.7 23.52,26.7 23.52,24.46 25.1,22.89 27.13,22.89 27.84,22.17 27.84,15.7
  pour Bottom (no thermals): 18.95,24.05 23.44,24.16 23.44,26.7 22.2,26.64 22.2,29.16 18.97,29.16
VOUTA  (via drill 0.2)
  Top 0.381: 26.82,8.13 27.64,8.13 R31.2 | 26.82,8.13 26.21,8.13 | 26.21,8.13 25.6,8.13 R33.2 25.4,8.13 25.4,9.35 23.77,9.35 R32.2 | v26.42,6.3 26.21,6.5 26.21,8.13 | Q7.D 27.03,12.8 29.87,12.8 Q5.D | Q3.D 20.12,12.6 20.12,9.75 19.91,9.55 R34.2 19.91,9.35 19.91,6.5 v18.9,5.49 | Q3.D 20.32,12.8 23.37,12.8 Q1.D 23.57,12.8 26.82,12.8 Q7.D | 20.12,14.83 20.12,12.8 Q3.D | 20.12,14.83 20.12,17.27 19.91,17.48 L3.2 | 26.82,8.13 26.82,12.6 Q7.D | 20.12,14.83 15.54,10.26 | 15.54,10.26 14.43,9.14 C5.A1 | v11.58,10.36 15.44,10.36 15.54,10.26 | 29.84,11.05 29.84,12.57 Q5.D | v30.48,15.24 30.48,12.7 29.97,12.7 Q5.D | v58.17,25.4 57.53,26.04 57.53,26.92 R35.1 | v74.93,26.04 74.3,26.67 v72.39,26.67 | v65.02,25.65 65.02,25.15 66.8,23.37 66.8,15.62 J3.5
  GND_PLANE/TRACE 0.381: v26.42,6.3 26.42,6.35 26.54,6.48 | v30.48,15.24 34.16,18.92 38.61,18.92 38.86,19.18 v49.66,19.18 | v72.39,26.67 72.14,26.42 69.09,26.42 v68.83,26.67
  Bottom 0.381: 3.45,9.35 3.86,9.35 U4.19 | 3.45,9.35 2.85,9.35 U4.20 | 6.5,10.77 6.5,10.97 5.08,10.97 3.45,9.35 | 6.5,10.77 6.5,9.35 U4.17 | 9.14,10.77 9.14,9.35 U4.15 | 6.5,10.77 9.14,10.77 | 11.58,10.77 11.58,10.97 9.35,10.97 9.14,10.77 | 11.58,10.77 v11.58,10.36 11.58,9.35 U4.13 | 11.58,10.77 14.22,10.77 14.22,9.35 U4.11 | 26.42,6.1 27.03,6.1 28.25,4.88 28.25,4.47 U3.11 | 26.42,6.1 25.81,6.1 25.81,4.47 U3.13 | v26.42,6.3 26.42,6.1 | 17.68,4.47 18.09,4.47 U3.19 | 17.68,4.47 16.87,4.47 U3.20 | 20.52,5.89 20.52,4.47 U3.17 | 20.52,5.89 19.1,5.89 18.8,5.59 | 17.68,4.47 18.8,5.59 | 20.52,5.89 23.16,5.89 23.16,4.47 U3.15 | v18.9,5.49 18.8,5.59 | 57.78,19.81 58.29,19.3 58.29,18.92 R19.1 | 57.78,19.81 57.78,24.51 58.42,25.15 | 58.42,25.15 59.18,25.91 R17.1 59.31,25.78 62.36,25.78 R15.1 62.48,25.91 65.02,25.91 | v58.17,25.4 58.42,25.15 | R22.1 79.12,26.16 76.07,26.16 R18.1 75.82,26.04 v74.93,26.04 | 65.02,25.91 65.91,25.91 R16.1 65.79,26.04 66.93,27.18 67.82,27.18 68.58,26.42 | 68.58,26.42 68.83,26.16 68.83,26.04 R21.1 | v72.39,26.67 72.39,26.04 R20.1 | v68.83,26.67 68.58,26.42 | v65.02,25.65 65.02,25.91 | v49.66,19.18 53.47,19.18 54.23,19.94 57.66,19.94 57.78,19.81

## Text on the board
Document: 4-Channel uCAT Subsystem Controller PCB / Rev: 2G Date: 29 May 2014 / Part No: B (BRICSAT) / Assy No: 4CU / Subsystem: MCAT / Micro-propulsion and Nanotechnology Lab / (c) George Washington University, 2014 / Design by: Samudra Haque, N3RDX, G19124781
tDocu: ^^^ | ^^^ | ^^^